# Altium schematic sheet 00_TITLE.SchDoc
size B; DocumentNumber: 1; SheetNumber: 1; SheetTotal: 12
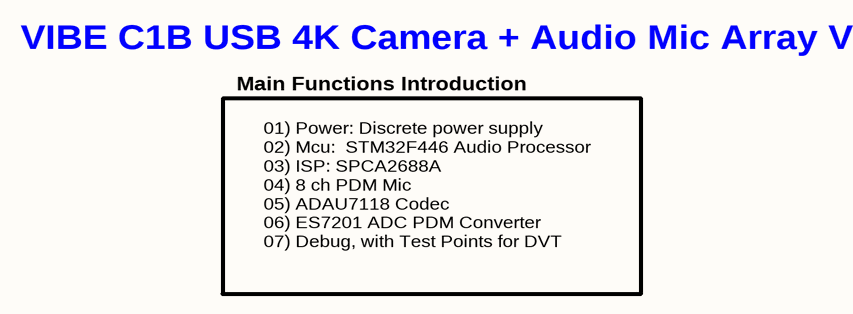
[diagram p0: 00_TITLE.SchDoc]

## Notes on the sheet
- VIBE C1B USB 4K Camera + Audio Mic Array V1
- Main Functions Introduction
- 01) Power: Discrete power supply
  02) Mcu:  STM32F446 Audio Processor
  03) ISP: SPCA2688A
  04) 8 ch PDM Mic
  05) ADAU7118 Codec
  06) ES7201 ADC PDM Converter
  07) Debug, with Test Points for DVT
- Title
- Size:
- Date:
- B
- Number:
- Time:
- Revision:
- Sheet
- of
- Author: Edward Lai
- Email: edward@vibe.us
- Vibe Inc
- Hangzhou
- vibe.us <http://vibe.us>
- File: